# EasyEDA Pro project ProPrj_pico debugger_2026-04-05.epro

# Schematic Schematic1
Board Name: Board1; Create Date: 2026-04-02; Page Name: P1; Project Name: pico debugger; Schematic Name: Schematic1; Update Date: 2026-04-02; Company: EasyEDA.com; Page Size: A3; Version: V1.0
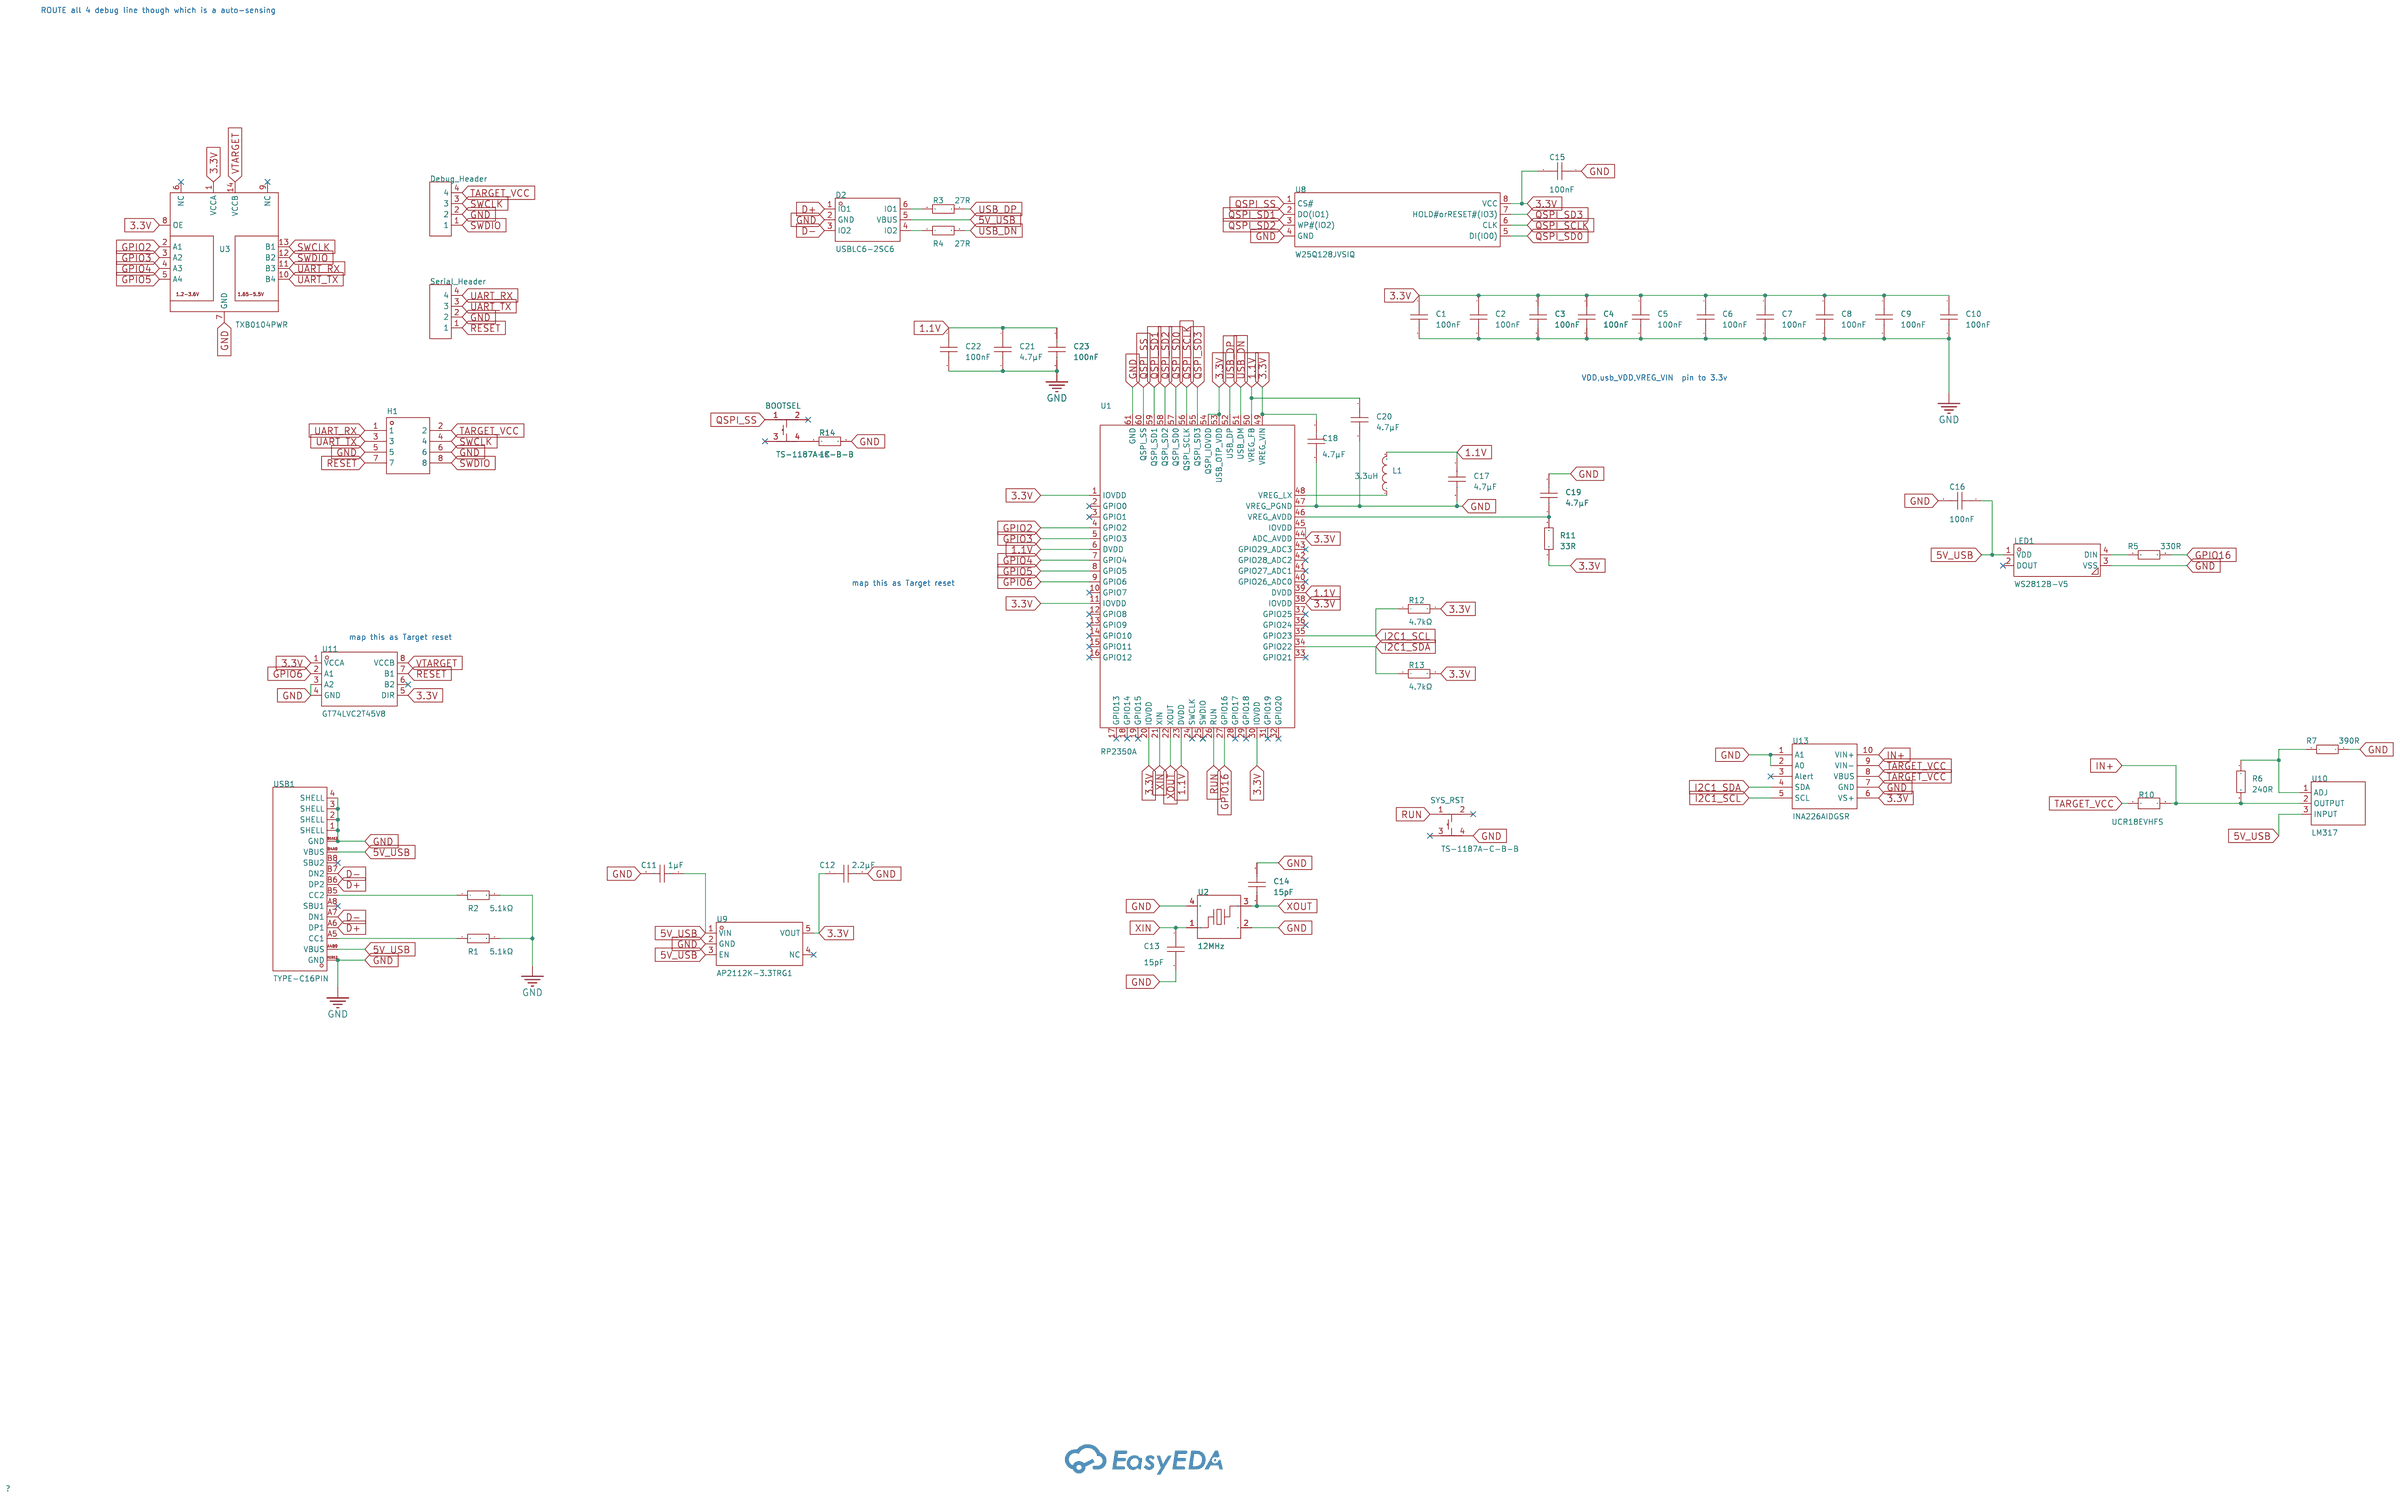
[diagram p0: schematic sheet]

## Parts
BOOTSEL  TS-1187A-C-B-B  [SW-SMD_4P-L5.1-W5.1-P3.70-LS6.5-TL_H1.6]
C1  100nF  [C0603]
C2  100nF  [C0603]
C3  100nF  [C0603]
C4  100nF  [C0603]
C5  100nF  [C0603]
C6  100nF  [C0603]
C7  100nF  [C0603]
C8  100nF  [C0603]
C9  100nF  [C0603]
C10  100nF  [C0603]
C11  1µF  [C0603]
C12  2.2µF  [C0603]
C13  15pF  [C0603]
C14  15pF  [C0603]
C15  100nF  [C0603]
C16  100nF  [C0603]
C17  4.7µF  [C0603]
C18  4.7µF  [C0603]
C19  4.7µF  [C0603]
C20  4.7µF  [C0603]
C21  4.7µF  [C0603]
C22  100nF  [C0603]
C23  100nF  [C0603]
D2  USBLC6-2SC6  [SOT-23-6_L2.9-W1.6-P0.95-LS2.8-BL]
Debug_Header  -  [HDR-TH_4P-P2.54-V-M]
H1  -  [HDR-TH_8P-P2.54-V-M-R2-C4-S2.54]
L1  3.3uH  [IND-SMD_L2.0-W1.6_AOTA-B201610S3R3-101-T]
LED1  WS2812B-V5  [LED-SMD_4P-L5.0-W5.0-LS5.4-TL-1]
R1  5.1kΩ  [R0402]
R2  5.1kΩ  [R0402]
R3  27R  [R0402]
R4  27R  [R0402]
R5  330R  [R0402]
R6  240R  [R0402]
R7  390R  [R0402]
R10  UCR18EVHFS  [R1206]
R11  33R  [R0402]
R12  4.7kΩ  [R0402]
R13  4.7kΩ  [R0402]
R14  1K  [R0402]
Serial_Header  -  [HDR-TH_4P-P2.54-V-M]
SYS_RST  TS-1187A-C-B-B  [SW-SMD_4P-L5.1-W5.1-P3.70-LS6.5-TL_H1.6]
U1  RP2350A  [QFN-60_L7.0-W7.0-P0.40-TL-EP3.4]
U2  12MHz  [CRYSTAL-SMD_4P-L3.2-W2.5-BL]
U3  TXB0104PWR  [TSSOP-14_L5.0-W4.4-P0.65-LS6.4-BL]
U8  W25Q128JVSIQ  [SOIC-8_L5.3-W5.3-P1.27-LS8.0-BL]
U9  AP2112K-3.3TRG1  [SOT-25-5_L2.9-W1.6-P0.95-LS2.8-BL]
U10  LM317  [TO-252-3_L6.5-W5.9-P4.60-LS10.0-BL]
U11  GT74LVC2T45V8  [VSSOP-8_L2.3-W2.0-P0.50-LS3.1-BL]
U13  INA226AIDGSR  [MSOP-10_L3.0-W3.0-P0.50-LS5.0-BL]
USB1  TYPE-C16PIN  [USB-C-SMD_TYPE-C16PIN]

## Library data of the parts
BOOTSEL SYS_RST = TS-1187A-C-B-B: Circuit:SPST Actuator Style:Round Button Operating Force:260gf Mounting Style:Brick nogging Switch Length:5.1mm Switch Width:5.1mm Switch Height:1.6mm Strike Gundam:不带 Contact Current:50mA Voltage Rating (DC):12V Insulation Resistance:- Actuator/Cap Color; LCSC Part Name: 5.1*5.1*1.6mm 立贴 轻触开关; Supplier Part: C1121873; Manufacturer: XKB Connectivity(中国星坤); Supplier Footprint: SMD; JLCPCB Part Class: Extended Part; Datasheet: https://atta.szlcsc.com/upload/public/pdf/source/20211011/CF465E46D2427DB66E133733EF19F823.pdf; Supplier: LCSC; Circuit: SPST; Actuator Style: Round Button; Operating Force: 260gf; Mounting Style: Brick nogging; Switch Length: 5.1mm; Switch Width: 5.1mm; Switch Height: 1.6mm; Strike Gundam: 不带; Contact Current: 50mA; Voltage Rating (DC): 12V; Actuator/Cap Color: 金色; With Lamp: No; Mechanical Life: 10万次; Operating Temperature: -30℃~+85℃
C1-C23 = CAP_0603: Supplier Footprint: 0603
D2 = USBLC6-2SC6_C2827654: Polarity:Unidirectional Reverse Stand-Off Voltage (Vrwm):5V Clamping Voltage:12V Peak Pulse Current (Ipp):6A Peak Pulse Power Dissipation (Ppp):150W Voltage - Breakdown:6V Reverse Leakage Current (Ir):80nA Number of Channels:2 Operating Temperature:-55℃~+; LCSC Part Name: ESD，可防30kV静电; Supplier Part: C2827654; Manufacturer: TECH PUBLIC(台舟); Supplier Footprint: SOT-23-6; JLCPCB Part Class: Extended Part; Datasheet: https://item.szlcsc.com/datasheet/USBLC6-2SC6/2973336.html; Supplier: LCSC; Polarity: Unidirectional; Reverse Stand-Off Voltage (Vrwm): 5V; Clamping Voltage: 12V; Peak Pulse Current (Ipp): 6A; Peak Pulse Power Dissipation (Ppp): 150W; Voltage - Breakdown: 6V; Reverse Leakage Current (Ir): 80nA; Number of Channels: 2; Operating Temperature: -55℃~+125℃; level of protection: IEC 61000-4-2；IEC 61000-4-4；IEC 61000-4-5; Type: ESD; Junction Capacitance: 0.35pF
Debug_Header Serial_Header = HDR-M_2.54_1x4P: Supplier Footprint: Through
H1 = HDR-M_2.54_2x4: Supplier Footprint: Through
L1 = AOTA-B201610S3R3-101-T: Inductance:3.3uH Current Rating:2.1A Current - Saturation(Isat):2.4A DC Resistance(DCR):115mΩ Type:Molded Inductor; LCSC Part Name: 3.3uH 2.4A; Supplier Part: C42411119; Manufacturer: ABRACON; Supplier Footprint: 0806; JLCPCB Part Class: Extended Part; Datasheet: https://item.szlcsc.com/datasheet/AOTA-B201610S3R3-101-T/44392932.html; Supplier: LCSC; Current Rating: 2.1A; Current - Saturation(Isat): 2.4A; DC Resistance(DCR): 115mΩ; Type: Molded Inductor
LED1 = WS2812B-V5_C2846931: Wavelength:G:520nm；B:471nm；R:621nm Luminous Intensity:B:215mcd；R:310mcd；G:780mcd Fixed-Frequency Pwm Mode:2kHz Data Transmission Rate:800Kbit/s Voltage - Supply:3.7V~5.3V Voltage - Supply:3.7V~5.3V Quiescent Current:0.6mA Operating Temperature:-40℃~+65℃ P; LCSC Part Name: 智能外控集成LED光源; Supplier Part: C2846931; Manufacturer: worldsemi; Supplier Footprint: SMD5050-4P; JLCPCB Part Class: Extended Part; Datasheet: https://item.szlcsc.com/datasheet/WS2812B-V5/3042466.html; Supplier: LCSC; Wavelength: G:520nm；B:471nm；R:621nm; Luminous Intensity: B:215mcd；R:310mcd；G:780mcd; Fixed-Frequency Pwm Mode: 2kHz; Data Transmission Rate: 800Kbit/s; Voltage - Supply: 3.7V~5.3V; Quiescent Current: 0.6mA; Operating Temperature: -40℃~+65℃; Peak Wavelength: G:520nm；R:621nm；B:471nm; Length: 5mm; Width: 5mm; Height: 1.57mm
R1-R7 R11-R14 = Res_0402: Supplier Footprint: 0402
R10 = UCR18EVHFS: Supplier Part: C20110261; Manufacturer: ROHM(罗姆); JLCPCB Part Class: Extended Part; Datasheet: https://item.szlcsc.com/datasheet/UCR18EVHFS/21439155.html; Supplier: LCSC
U1 = RP2350A_C42411118: LCSC Part Name: 微控制器; Supplier Part: C42411118; Manufacturer: Raspberry Pi(树莓派); Supplier Footprint: QFN-60-EP(7x7); JLCPCB Part Class: Extended Part; Datasheet: https://item.szlcsc.com/datasheet/RP2350A/44392931.html; Supplier: LCSC
U2 = ABM8-272-T3_C20625731: Type:Crystal Oscillator Frequency:12MHz Normal temperature Frequency Tolerance:±30ppm Normal temperature Frequency Tolerance:±30ppm Load Capacitance:10pF Frequency Stability:±30ppm Frequency Stability:±30ppm Equivalent Series Resistance(ESR):50Ω Operating; LCSC Part Name: 12MHz ±30ppm 10pF; Supplier Part: C20625731; Manufacturer: ABRACON; Manufacturer Part: ABM8-272-T3; Supplier Footprint: SMD3225-4P; JLCPCB Part Class: Extended Part; Datasheet: https://item.szlcsc.com/datasheet/ABM8-272-T3/22032038.html; Supplier: LCSC; Type: Crystal Oscillator; Normal temperature Frequency Tolerance: ±30ppm; Load Capacitance: 10pF; Frequency Stability: ±30ppm; Equivalent Series Resistance(ESR): 50Ω; Operating Temperature: -40℃~+85℃
U3 = TXB0104PWR: Channel Type:Bidirectional Input Signal:CMOS Output Signal:CMOS Data Rate:100Mbps Voltage - Supply(VCCA):1.2V~3.6V Voltage - Supply(VCCA):1.2V~3.6V Voltage - Supply(VCCB):1.65V~5.5V Voltage - Supply(VCCB):1.65V~5.5V Number of Elements:1 Number of Circuits; LCSC Part Name: 100Mbps 4位双向电平转换器; Supplier Part: C60708; Manufacturer: TI(德州仪器); Supplier Footprint: TSSOP-14; JLCPCB Part Class: Extended Part; Datasheet: http://www.ti.com/cn/lit/gpn/txb0104; Supplier: LCSC; Channel Type: Bidirectional; Input Signal: CMOS; Output Signal: CMOS; Data Rate: 100Mbps; Voltage - Supply(VCCA): 1.2V~3.6V; Voltage - Supply(VCCB): 1.65V~5.5V; Number of Elements: 1; Number of Circuits: 4; Output Type: Tri-State; Operating Temperature: -40℃~+85℃; Features: Auto Direction Detection
U8 = W25Q128JVSIQ_C113767: Interface:SPI Memory Size:- Clock Frequency:133MHz Voltage - Supply:2.7V~3.6V Voltage - Supply:2.7V~3.6V Program / Erase Cycles:100,000 Cycles Page Programming Time (Tpp):3ms Operating Temperature:- Operating Temperature:-; LCSC Part Name: 支持双路/四路SPI接口的3V、128Mbit 串行闪存; Supplier Part: C113767; Manufacturer: Winbond(华邦); Supplier Footprint: SOIC-8-208mil; JLCPCB Part Class: Extended Part; Datasheet: https://item.szlcsc.com/datasheet/W25Q128JVSIQ/115003.html; Supplier: LCSC; Interface: SPI; Clock Frequency: 133MHz; Voltage - Supply: 2.7V~3.6V; Program / Erase Cycles: 100,000 Cycles; Page Programming Time (Tpp): 3ms
U9 = AP2112K-3.3TRG1: Output Type:Fixed Voltage - Supply:6V Output Voltage:3.3V Output Voltage:3.3V Output Current:600mA Power Supply Rejection Ratio (PSRR):65dB@(1kHz) Voltage Dropout:250mV@(600mA) standby current:55uA Noise:50uVrms Features:Enable；Over Temperature Protection; LCSC Part Name: 输入6V 输出3.3V 600mA; Supplier Part: C51118; Manufacturer: DIODES(美台); Supplier Footprint: SOT-25-5; JLCPCB Part Class: Extended Part; Datasheet: https://item.szlcsc.com/datasheet/AP2112K-3.3TRG1/52131.html; Supplier: LCSC; Output Type: Fixed; Voltage - Supply: 6V; Output Voltage: 3.3V; Output Current: 600mA; Power Supply Rejection Ratio (PSRR): 65dB@(1kHz); Voltage Dropout: 250mV@(600mA); standby current: 55uA; Noise: 50uVrms; Features: Enable；Over Temperature Protection；Over Current Protection; Operating Temperature: -40℃~+85℃@(Ta); Output Configuration: Positive; Number of Outputs: 1
U10 = LM317_C42457465: Output Type:Adjustable Voltage - Supply:40V Output Voltage:1.2V~37V Output Voltage:1.2V~37V Output Current:1.5A Power Supply Rejection Ratio (PSRR):65dB@(120Hz) Voltage Dropout:- standby current:- Noise:- Features:Short Circuit Protection；Over Temperature; LCSC Part Name: 1.2V~37V 1.5A 40V; Supplier Part: C42457465; Manufacturer: GOODWORK(固得沃克); Supplier Footprint: TO-252; JLCPCB Part Class: Extended Part; Datasheet: https://item.szlcsc.com/datasheet/LM317/44529604.html; Supplier: LCSC; Output Type: Adjustable; Voltage - Supply: 40V; Output Voltage: 1.2V~37V; Output Current: 1.5A; Power Supply Rejection Ratio (PSRR): 65dB@(120Hz); Features: Short Circuit Protection；Over Temperature Protection; Operating Temperature: 0℃~+125℃; Output Configuration: Positive; Number of Outputs: 1
U11 = GT74LVC2T45V8: Input type:- output type:Tri-State Voltage - Supply:1.65V~5.5V Voltage - Supply:1.65V~5.5V Number of Elements:2 Number of Bits per Element:2 Channel Type:Bidirectional Current - Output Low(IOL):32mA Current - Output High(IOH):62mA Logic Family:74LVC Opera; LCSC Part Name: 具备电压转换功能的双位双电源总线收发器; Supplier Part: C22356905; Manufacturer: GTIC(谷泰微); Supplier Footprint: VSSOP-8; JLCPCB Part Class: Extended Part; Datasheet: https://item.szlcsc.com/datasheet/GT74LVC2T45V8/23790625.html; Supplier: LCSC; output type: Tri-State; Voltage - Supply: 1.65V~5.5V; Number of Elements: 2; Number of Bits per Element: 2; Channel Type: Bidirectional; Current - Output Low(IOL): 32mA; Current - Output High(IOH): 62mA; Logic Family: 74LVC; Operating Temperature: -40℃~+125℃; Quiescent Current: 15uA; Propagation Delay: 3.5ns@3.3V,15pF
U13 = INA226AIDGSR: Number of Channels:- Vcm - Common Mode Voltage:300mV~40V Vcm - Common Mode Voltage:300mV~40V Gain:- Bandwidth:- Ib - Input Bias Current:10nA Vos - Input Offset Voltage:2.5uV Operating Temperature:-40℃~+125℃ Operating Temperature:-40℃~+125℃ Differential Vo; LCSC Part Name: 高侧/低侧测量双向电流/功率监视器，具有I²C兼容接口; Supplier Part: C49851; Manufacturer: TI(德州仪器); Supplier Footprint: VSOP-10; JLCPCB Part Class: Extended Part; Datasheet: https://item.szlcsc.com/datasheet/INA226AIDGSR/50860.html; Supplier: LCSC; Vcm - Common Mode Voltage: 300mV~40V; Ib - Input Bias Current: 10nA; Vos - Input Offset Voltage: 2.5uV; Operating Temperature: -40℃~+125℃; Differential Voltage: -40V~+40V; Single Supply: 2.7V~5.5V; Quiescent Current: 330uA; Input Offset Voltage Drift(Vos TC): 0.1uV/℃; Common Mode Rejection Ratio (CMRR): 140dB
USB1 = TYPE-C16PIN: Connector Type:Type-C Protocol Standard:- Gender:Female Mounting Type:Surface Mount, Right Angle Number of Contacts:16P Number of Ports:1 Current Rating-Power:3A Voltage Rating:30V Connect-Disconnect Life:10,000 Cycles Supplementary Features:- Center Heig; LCSC Part Name: 16P卧贴母座; Supplier Part: C393939; Manufacturer: SHOU HAN(首韩); Supplier Footprint: SMD; JLCPCB Part Class: Extended Part; Datasheet: https://item.szlcsc.com/datasheet/TYPE-C16PIN/372551.html; Supplier: LCSC; Connector Type: Type-C; Gender: Female; Mounting Type: Surface Mount, Right Angle; Number of Contacts: 16P; Number of Ports: 1; Current Rating-Power: 3A; Voltage Rating: 30V; Connect-Disconnect Life: 10,000 Cycles; Detection color: Black; Operating Temperature: -40℃~+85℃

## Nets
1.1V: C17.1 C20.1 C21.1 C22.1 C23.1 L1.2 U1.6(DVDD) U1.23(DVDD) U1.39(DVDD) U1.50(VREG_FB)
3.3V: C1.1 C2.1 C3.1 C4.1 C5.1 C6.1 C7.1 C8.1 C9.1 C10.1 C12.1 C15.2 C18.1 R11.1 R12.2 R13.2 U1.1(IOVDD) U1.11(IOVDD) U1.20(IOVDD) U1.30(IOVDD) U1.38(IOVDD) U1.44(ADC_AVDD) U1.45(IOVDD) U1.49(VREG_VIN) U1.53(USB_OTP_VDD) U1.54(QSPI_IOVDD) U3.1(VCCA) U3.8(OE) U8.8(VCC) U9.5(VOUT) U11.1(VCCA) U11.5(DIR) U13.6(VS+)
5V_USB: C11.1 C16.1 D2.5(VBUS) LED1.1(VDD) U9.1(VIN) U9.3(EN) U10.3(INPUT) USB1.A4B9(VBUS) USB1.B4A9(VBUS)
GND: C1.2 C2.2 C3.2 C4.2 C5.2 C6.2 C7.2 C8.2 C9.2 C10.2 C11.2 C12.2 C13.2 C14.1 C15.1 C16.2 C17.2 C18.2 C19.2 C20.2 C21.2 C22.2 C23.2 D2.2(GND) Debug_Header.2 H1.5 H1.6 LED1.3(VSS) R1.2 R2.2 R7.2 R14.2 Serial_Header.2 SYS_RST.4 U1.47(VREG_PGND) U1.61(GND) U2.2(GND) U2.4(GND) U3.7(GND) U8.4(GND) U9.2(GND) U11.3(A2) U11.4(GND) U13.1(A1) U13.2(A0) U13.7(GND) USB1.1(SHELL) USB1.2(SHELL) USB1.3(SHELL) USB1.4(SHELL) USB1.A1B12(GND) USB1.B1A12(GND)
D+: D2.1(IO1) USB1.A6(DP1) USB1.B6(DP2)
D-: D2.3(IO2) USB1.A7(DN1) USB1.B7(DN2)
GPIO2: U1.4(GPIO2) U3.2(A1)
GPIO3: U1.5(GPIO3) U3.3(A2)
GPIO4: U1.7(GPIO4) U3.4(A3)
GPIO5: U1.8(GPIO5) U3.5(A4)
GPIO6: U1.9(GPIO6) U11.2(A1)
GPIO16: R5.2 U1.27(GPIO16)
I2C1_SCL: R12.1 U1.35(GPIO23) U13.5(SCL)
I2C1_SDA: R13.1 U1.34(GPIO22) U13.4(SDA)
IN+: R6.2 R10.2 U10.2(OUTPUT) U13.10(VIN+)
QSPI_SCLK: U1.56(QSPI_SCLK) U8.6(CLK)
QSPI_SD0: U1.57(QSPI_SD0) U8.5(DI(IO0))
QSPI_SD1: U1.59(QSPI_SD1) U8.2(DO(IO1))
QSPI_SD2: U1.58(QSPI_SD2) U8.3(WP#(IO2))
QSPI_SD3: U1.55(QSPI_SD3) U8.7(HOLD#orRESET#(IO3))
QSPI_SS: BOOTSEL.1 U1.60(QSPI_SS) U8.1(CS#)
RESET: H1.7 Serial_Header.1 U11.7(B1)
RUN: SYS_RST.1 U1.26(RUN)
SWCLK: Debug_Header.3 H1.4 U3.13(B1)
SWDIO: Debug_Header.1 H1.8 U3.12(B2)
TARGET_VCC: Debug_Header.4 H1.2 R10.1 U13.8(VBUS) U13.9(VIN-)
UART_RX: H1.1 Serial_Header.4 U3.11(B3)
UART_TX: H1.3 Serial_Header.3 U3.10(B4)
USB_DN: R4.2 U1.51(USB_DM)
USB_DP: R3.1 U1.52(USB_DP)
VTARGET: U3.14(VCCB) U11.8(VCCB)
XIN: C13.1 U1.21(XIN) U2.1
XOUT: C14.2 U1.22(XOUT) U2.3
$1N4816: R1.1 USB1.A5(CC1)
$1N4872: R2.1 USB1.B5(CC2)
$1N5063: D2.6(IO1) R3.2
$1N5093: D2.4(IO2) R4.1
$1N6963: LED1.4(DIN) R5.1
$1N6977: R6.1 R7.1 U10.1(ADJ)
$1N7783: L1.1 U1.48(VREG_LX)
$1N8068: C19.1 R11.2 U1.46(VREG_AVDD)
$1N9279: BOOTSEL.4 R14.1

Not connected (* = marked no-connect by the designer): BOOTSEL 2* 3*; LED1 2(DOUT)*; SYS_RST 2* 3*; U1 2(GPIO0)* 3(GPIO1)* 10(GPIO7)* 12(GPIO8)* 13(GPIO9)* 14(GPIO10)* 15(GPIO11)* 16(GPIO12)* 17(GPIO13)* 18(GPIO14)* 19(GPIO15)* 24(SWCLK)* 25(SWDIO)* 28(GPIO17)* 29(GPIO18)* 31(GPIO19)* 32(GPIO20)* 33(GPIO21)* 36(GPIO24)* 37(GPIO25)* 40(GPIO26_ADC0)* 41(GPIO27_ADC1)* 42(GPIO28_ADC2)* 43(GPIO29_ADC3)*; U3 6(NC)* 9(NC)*; U9 4(NC)*; U11 6(B2)*; U13 3(Alert)*; USB1 A8(SBU1)* B8(SBU2)*

## Notes on the sheet
- ROUTE all 4 debug line though which is a auto-sensing
- VDD,usb_VDD,VREG_VIN  pin to 3.3v
- map this as Target reset
- map this as Target reset

# Board PCB1
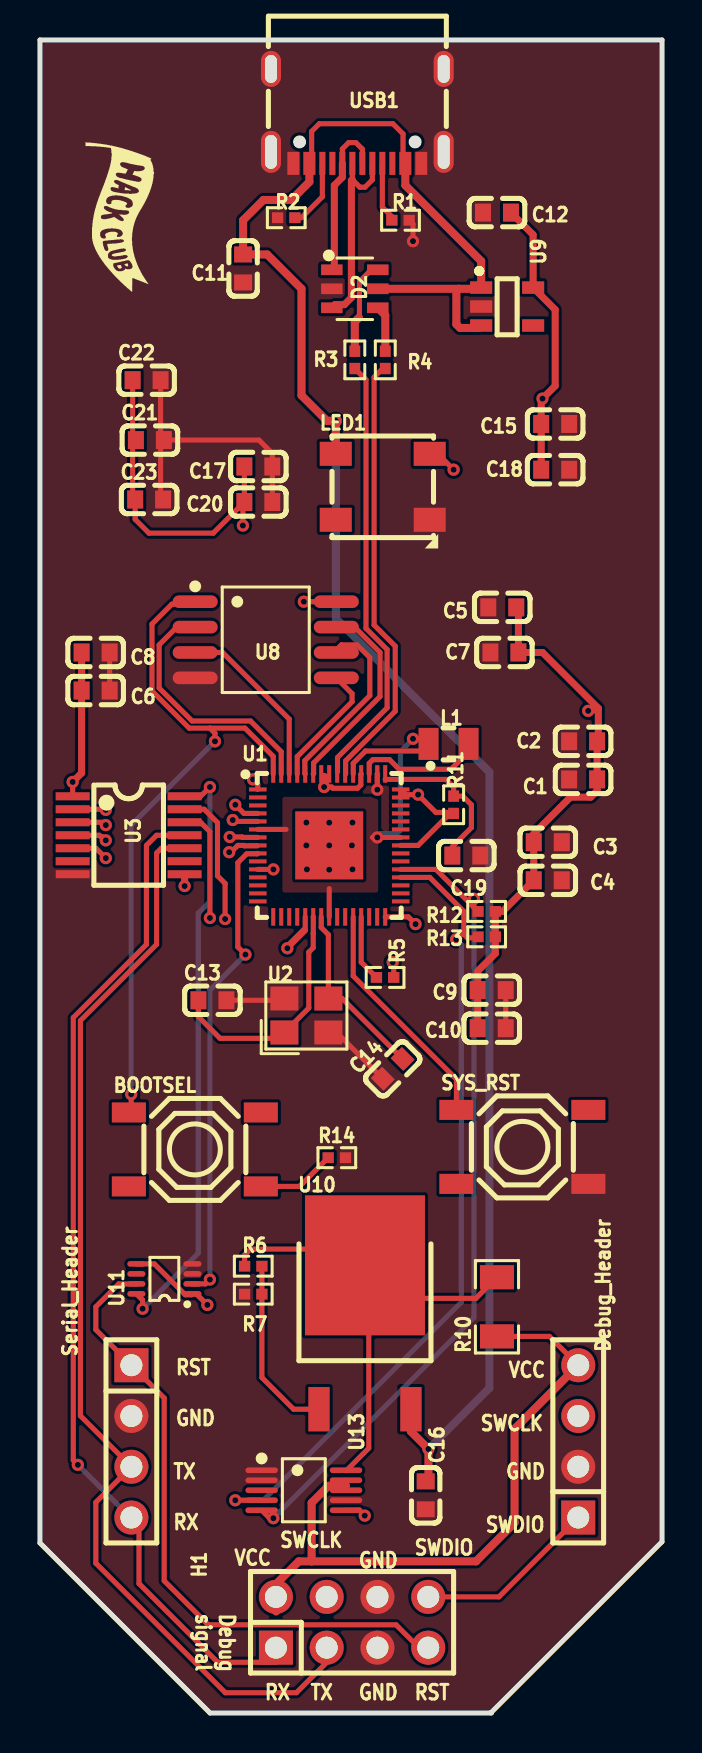
[diagram p1: board, top side]
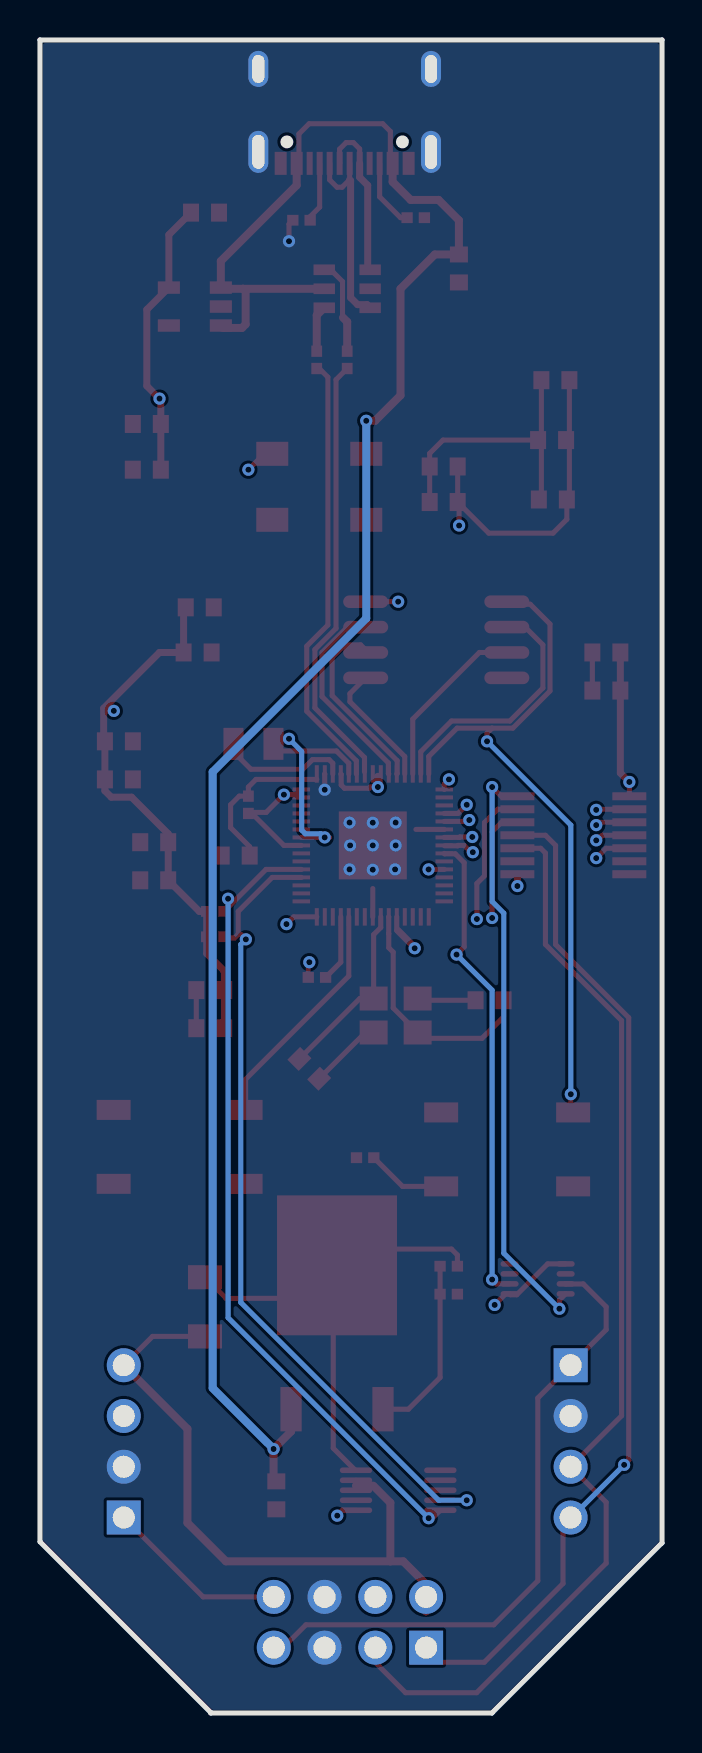
[diagram p2: board, bottom side, seen from below]

Outline 31.12 x 83.69 mm; copper layers: Top Layer, GND, POWERS, Bottom Layer. Coordinates in mm from the lower left corner of the outline.
Outline path: 0,83.69 31.12,83.69 31.12,8.57 22.57,0.03 22.57,0 8.51,0 0,8.51 0,83.69
Stack: Top Layer 0.035mm Outer layer thickness 1oz / Dielectric1 0.2104mm 7628 RC49% 8.6mil / GND 0.0152mm Inner layer thickness / Dielectric2 1.065mm 1.1mm H/HOZ Copper / POWERS 0.0152mm Inner layer thickness / Dielectric3 0.2104mm 7628 RC49% 8.6mil / Bottom Layer 0.035mm Outer layer thickness 1oz

## Design rules (mm)
net USB_DP: DP1
net USB_DN: DP1
template: Custom Config
spacing copperThickness1oz (default): track to track 0.102, other pairs 0.152 to 0.3
spacing copperThickness2oz: track to track 0.203, other pairs 0.152 to 0.3
track width copperThickness1oz (default): min 0.127, default 0.254, max 2.54
track width copperThickness2oz: min 0.203, default 0.254, max 2.54
differential pair differentialPair (default): width min 0.127, default 0.254, max 2.54; gap min 0.152, default 0.152
via viaSize (default): diameter min 0.5, default 0.61, max 10; hole min 0.3, default 0.305, max 6.3

## Placement (name value [footprint] x y rotation side)
BOOTSEL  TS-1187A-C-B-B  [SW-SMD_4P-L5.1-W5.1-P3.70-LS6.5-TL_H1.6]  7.75 28.19 0 top
C1  100nF  [C0603]  27.17 46.7 180 top
C2  100nF  [C0603]  27.17 48.61 180 top
C3  100nF  [C0603]  25.4 43.56 0 top
C4  100nF  [C0603]  25.4 41.66 0 top
C5  100nF  [C0603]  23.12 55.31 180 top
C6  100nF  [C0603]  2.78 51.15 0 top
C7  100nF  [C0603]  23.23 53.05 180 top
C8  100nF  [C0603]  2.78 53.05 0 top
C9  100nF  [C0603]  22.6 36.16 0 top
C10  100nF  [C0603]  22.6 34.26 0 top
C11  1µF  [C0603]  10.16 72.26 270 top
C12  2.2µF  [C0603]  22.86 75.06 180 top
C13  15pF  [C0603]  8.63 35.65 0 top
C14  15pF  [C0603]  17.64 32.23 45 top
C15  100nF  [C0603]  25.77 64.48 180 top
C16  100nF  [C0603]  19.29 10.89 270 top
C17  4.7µF  [C0603]  10.92 62.36 0 top
C18  4.7µF  [C0603]  25.77 62.2 0 top
C19  4.7µF  [C0603]  21.33 42.89 0 top
C20  4.7µF  [C0603]  10.92 60.58 0 top
C21  4.7µF  [C0603]  5.5 63.68 0 top
C22  100nF  [C0603]  5.33 66.67 0 top
C23  100nF  [C0603]  5.46 60.71 0 top
D2  USBLC6-2SC6  [SOT-23-6_L2.9-W1.6-P0.95-LS2.8-BL]  15.75 71.25 270 top
Debug_Header  -  [HDR-TH_4P-P2.54-V-M]  26.92 13.59 90 top
H1  -  [HDR-TH_8P-P2.54-V-M-R2-C4-S2.54]  15.61 4.54 0 top
L1  3.3uH  [IND-SMD_L2.0-W1.6_AOTA-B201610S3R3-101-T]  20.44 48.48 180 top
LED1  WS2812B-V5  [LED-SMD_4P-L5.0-W5.0-LS5.4-TL-1]  17.15 61.34 0 top
R1  5.1kΩ  [R0402]  18.03 74.68 0 top
R2  5.1kΩ  [R0402]  12.32 74.8 180 top
R3  27R  [R0402]  15.75 67.69 90 top
R4  27R  [R0402]  17.27 67.69 270 top
R5  330R  [R0402]  17.26 36.8 180 top
R6  240R  [R0402]  10.67 22.35 180 top
R7  390R  [R0402]  10.67 20.95 180 top
R10  UCR18EVHFS  [R1206]  22.86 20.32 90 top
R11  33R  [R0402]  20.69 45.43 90 top
R12  4.7kΩ  [R0402]  22.34 40.1 0 top
R13  4.7kΩ  [R0402]  22.34 38.83 0 top
R14  1K  [R0402]  14.85 27.78 0 top
Serial_Header  -  [HDR-TH_4P-P2.54-V-M]  4.57 13.59 270 top
SYS_RST  TS-1187A-C-B-B  [SW-SMD_4P-L5.1-W5.1-P3.70-LS6.5-TL_H1.6]  24.13 28.32 0 top
U1  RP2350A  [QFN-60_L7.0-W7.0-P0.40-TL-EP3.4]  14.47 43.4 0 top
U2  12MHz  [CRYSTAL-SMD_4P-L3.2-W2.5-BL]  13.33 34.89 0 top
U3  TXB0104PWR  [TSSOP-14_L5.0-W4.4-P0.65-LS6.4-BL]  4.44 43.91 270 top
U8  W25Q128JVSIQ  [SOIC-8_L5.3-W5.3-P1.27-LS8.0-BL]  11.29 53.69 270 top
U9  AP2112K-3.3TRG1  [SOT-25-5_L2.9-W1.6-P0.95-LS2.8-BL]  23.37 70.36 270 top
U10  LM317  [TO-252-3_L6.5-W5.9-P4.60-LS10.0-BL]  16.26 18.8 0 top
U11  GT74LVC2T45V8  [VSSOP-8_L2.3-W2.0-P0.50-LS3.1-BL]  6.22 21.72 90 top
U13  INA226AIDGSR  [MSOP-10_L3.0-W3.0-P0.50-LS5.0-BL]  13.2 11.14 270 top
USB1  TYPE-C16PIN  [USB-C-SMD_TYPE-C16PIN]  15.88 79.88 180 top

## Footprints (pads in the part's own frame, mm; a bottom-side part is the same pattern mirrored in y, then rotated)
C0603
  rect 0.8x0.9 smd: 1(-0.7,0) 2(0.7,0)
CRYSTAL-SMD_4P-L3.2-W2.5-BL
  rect 1.4x1.2 smd: 1(-1.1,-0.85) 2(1.1,-0.85) 3(1.1,0.85) 4(-1.1,0.85)
HDR-TH_4P-P2.54-V-M
  rect 1.7x1.7 hole 1.1: 1(-3.81,0)
  round 1.7 hole 1.1: 2(-1.27,0) 3(1.27,0) 4(3.81,0)
HDR-TH_8P-P2.54-V-M-R2-C4-S2.54
  rect 1.7x1.7 hole 1.1: 1(-3.81,-1.27)
  round 1.7 hole 1.1: 2(-3.81,1.27) 3(-1.27,-1.27) 4(-1.27,1.27) 5(1.27,-1.27) 6(1.27,1.27) 7(3.81,-1.27) 8(3.81,1.27)
IND-SMD_L2.0-W1.6_AOTA-B201610S3R3-101-T
  rect 1x1.6 smd: 1(-1,0) 2(1,0)
LED-SMD_4P-L5.0-W5.0-LS5.4-TL-1
  rect 1.6x1.2 smd: 1(-2.35,1.65) 2(-2.35,-1.65) 3(2.35,-1.65) 4(2.35,1.65)
MSOP-10_L3.0-W3.0-P0.50-LS5.0-BL
  oval 0.28x1.62 smd: 1(-1,-2.11) 2(-0.5,-2.11) 3(0,-2.11) 4(0.5,-2.11) 5(1,-2.11) 6(1,2.11) 7(0.5,2.11) 8(0,2.11) 9(-0.5,2.11) 10(-1,2.11)
QFN-60_L7.0-W7.0-P0.40-TL-EP3.4
  rect 0.875x0.2 smd: 1(-3.575,2.8) 2(-3.575,2.4) 3(-3.575,2) 4(-3.575,1.6) 5(-3.575,1.2) 6(-3.575,0.8) 7(-3.575,0.4) 8(-3.575,0) 9(-3.575,-0.4) 10(-3.575,-0.8) 11(-3.575,-1.2) 12(-3.575,-1.6) 13(-3.575,-2) 14(-3.575,-2.4) 15(-3.575,-2.8) 31(3.575,-2.8) 32(3.575,-2.4) 33(3.575,-2.001) 34(3.575,-1.6) 35(3.575,-1.2) 36(3.575,-0.8) 37(3.575,-0.4) 38(3.575,-0.001) 39(3.575,0.4) 40(3.575,0.8) 41(3.575,1.2) 42(3.575,1.6) 43(3.575,2) 44(3.575,2.4) 45(3.575,2.8)
  rect 0.2x0.875 smd: 16(-2.8,-3.575) 17(-2.4,-3.575) 18(-2,-3.575) 19(-1.6,-3.575) 20(-1.2,-3.575) 21(-0.8,-3.575) 22(-0.4,-3.575) 23(0,-3.575) 24(0.4,-3.575) 25(0.8,-3.575) 26(1.2,-3.575) 27(1.6,-3.575) 28(2,-3.575) 29(2.4,-3.575) 30(2.8,-3.575) 46(2.8,3.575) 47(2.4,3.575) 48(2,3.575) 49(1.6,3.575) 50(1.2,3.575) 51(0.8,3.575) 52(0.4,3.575) 53(0,3.575) 54(-0.4,3.575) 55(-0.8,3.575) 56(-1.2,3.575) 57(-1.6,3.575) 58(-2,3.575) 59(-2.4,3.575) 60(-2.8,3.575)
  rect 3.4x3.4 smd: 61(0,0)
R0402
  rect 0.566x0.54 smd: 1(-0.433,0) 2(0.433,0)
R1206
  rect 1.208x1.701 smd: 1(-1.479,0) 2(1.479,0)
SOIC-8_L5.3-W5.3-P1.27-LS8.0-BL
  oval 0.63x2.25 smd: 1(-1.905,-3.53) 2(-0.635,-3.53) 3(0.635,-3.53) 4(1.905,-3.53) 5(1.905,3.53) 6(0.635,3.53) 7(-0.635,3.53) 8(-1.905,3.53)
SOT-23-6_L2.9-W1.6-P0.95-LS2.8-BL
  rect 0.532x1.072 smd: 1(-0.95,-1.149) 2(0,-1.149) 3(0.95,-1.149) 4(0.95,1.149) 5(0,1.149) 6(-0.95,1.149)
SOT-25-5_L2.9-W1.6-P0.95-LS2.8-BL
  rect 0.623x1.105 smd: 1(-0.95,-1.3) 2(-0.001,-1.3) 3(0.95,-1.3) 4(0.95,1.3) 5(-0.95,1.3)
SW-SMD_4P-L5.1-W5.1-P3.70-LS6.5-TL_H1.6
  rect 1.7x1 smd: 1(-3.3,1.85) 2(3.3,1.85) 3(-3.3,-1.85) 4(3.3,-1.85)
TO-252-3_L6.5-W5.9-P4.60-LS10.0-BL
  rect 1.064x2.219 smd: 1(-2.3,-3.599) 3(2.3,-3.599)
  rect 6x7 smd: 2(0,3.599)
TSSOP-14_L5.0-W4.4-P0.65-LS6.4-BL
  rect 0.4x1.7 smd: 1(-1.95,-2.8) 2(-1.3,-2.8) 3(-0.65,-2.8) 4(0,-2.8) 5(0.65,-2.8) 6(1.3,-2.8) 7(1.95,-2.8) 8(1.95,2.8) 9(1.3,2.8) 10(0.65,2.8) 11(0,2.8) 12(-0.65,2.8) 13(-1.3,2.8) 14(-1.95,2.8)
USB-C-SMD_TYPE-C16PIN
  oval 1x2.1 hole 0.6x1.7: 1(-4.32,1.788) 2(4.32,1.788)
  oval 1x1.8 hole 0.6x1.4: 3(-4.32,-2.362) 4(4.32,-2.362)
  rect 0.6x1.15 smd: A1B12(-3.2,2.362) A4B9(-2.4,2.362) B1A12(3.2,2.362) B4A9(2.4,2.362)
  rect 0.3x1.15 smd: A5(-1.25,2.362) A6(-0.25,2.362) A7(0.25,2.362) A8(1.25,2.362) B5(1.75,2.362) B6(0.75,2.362) B7(-0.75,2.362) B8(-1.75,2.362)
VSSOP-8_L2.3-W2.0-P0.50-LS3.1-BL
  oval 0.28x0.905 smd: 1(-0.75,-1.403) 2(-0.25,-1.403) 3(0.25,-1.403) 4(0.75,-1.403) 5(0.75,1.403) 6(0.25,1.403) 7(-0.25,1.403) 8(-0.75,1.403)

## Nets
As in the schematic.

Pads without a net: BOOTSEL 2 3; LED1 2; SYS_RST 2 3; U1 2 3 10 12 13 14 15 16 17 18 19 24 25 28 29 31 32 33 36 37 40 41 42 43; U3 6 9; U9 4; U11 6; U13 3; USB1 A8 B8

## Via types
v1: diameter 0.61, hole 0.305, Top Layer to Bottom Layer, 52 vias

## Routing (per net, layer and track width the routed paths; a pad name or vN(x,y) marks a point on that pad's centre or on a via; arc(x,y) is an arc through that point)
1.1V: length 52.3
  Top Layer w0.254: 10.15,60.51 8.67,59.02 5.45,59.02 4.76,59.71 C23.1 4.63,60.83 C22.1 ; 10.15,60.51 C20.1 C17.1 ; 10.15,60.51 v1(10.15,59.4) ; U1.6 12.31,44.2 ; U1.23 14.47,41.24 ; U1.39 16.63,43.8 ; U1.50 15.67,47.51 16.28,48.13 19.08,48.13 L1.2 19.18,48.74 v1(18.66,48.74)
  POWERS w0.254: v1(16.87,43.8) 17.28,43.8 17.9,44.42 17.9,52.67 11.17,59.4 v1(10.15,59.4)
  Bottom Layer w0.254: v1(18.66,48.74) 18.02,48.1 18.02,44.16 17.84,43.98 17.06,43.98 v1(16.87,43.8)
3.3V: length 71.3
  Top Layer w0.254: 13.27,39.83 13.27,39.15 ; U8.8 v1(13.2,55.59) ; v1(10.66,46.7) 10.89,46.47 U1.1 ; v1(8.37,20.41) 7.82,20.97 7.63,20.97 7.58,20.92 7.27,20.92 5.72,22.47 U11.5 ; v1(18.79,39.46) 18.42,39.83 17.27,39.83 ; U1.11 v1(11.68,42.2) ; U1.38 18.91,43.4 20.51,45 R11.1 20.64,45.05 19.8,45.05 v1(18.91,45.94) 18.3,45.94 U1.45 U1.44 ; 27.93,48.67 C2.1 ; 27.93,50.26 27.8,50.13 v1(27.42,50.13) ; U13.6 15.98,10.14 v1(16.25,9.87) ; U1.49 16.05,46.96 16.05,46.42 15.88,46.26 14.65,46.26 14.59,46.32 v1(14.21,46.32) ; U3.1 v1(1.64,46.58) ; C5.1 23.93,55.2 ; 25.07,65.69 v1(25.14,65.75)
  Top Layer w0.35: C2.1 C1.1 27.87,46.13 27.55,45.81 26.53,45.81 24.7,43.98 C4.1 23.14,40.1 R12.2 R13.2 22.78,37.99 21.9,37.11 C9.1 C10.1 ; 23.56,75.06 24.67,73.95 U9.5 25.77,70.2 25.77,66.39 v1(25.14,65.75) ; U3.8 v1(7.24,41.37) ; 27.93,48.67 27.93,50.26 25.14,53.05 C7.1 23.93,55.2 ; C18.1 C15.2 25.07,65.69 ; 13.22,39.15 12.37,38.31 v1(12.37,38.26) ; 2.08,53.05 2.08,47.03 v1(1.64,46.58)
  Top Layer w0.4: 14.21,46.83 v1(14.21,46.32)
5V_USB: length 102.6
  Top Layer w0.254: 18.16,77.99 18.16,78.99 17.65,79.5 13.97,79.5 13.59,79.12 13.59,77.99
  Top Layer w0.4: 20.96,71.25 20.83,71.12 20.83,69.47 21.01,69.29 21.95,69.29 22.07,69.41 ; 20.96,71.25 D2.5 ; 20.96,71.25 21.64,71.25 21.7,71.31 22.07,71.31 22.07,72.63 18.28,76.42 USB1.A4B9 ; LED1.1 v1(14.8,64.64) 14.35,64.64 13.08,65.91 13.08,71.25 11.37,72.96 C11.1 10.16,74.68 11.18,75.69 12.57,75.69 13.47,76.59 USB1.B4A9 ; U10.3 18.56,14.08 v1(19.43,13.21) 19.43,11.65
  Bottom Layer w0.4: v1(19.43,13.21) 22.48,16.26 22.48,47.07 14.8,54.76 v1(14.8,64.64)
GND: length 26.5
  Top Layer w0.254: C21.2 10.96,63.68 11.62,63.01 11.62,60.58 ; C23.2 6.03,60.83 6.03,66.67 ; C9.2 C10.2 ; v1(16.87,46.19) 16.87,46.97 16.87,46.98 ; R1.2 18.66,74.48 v1(18.66,73.63) ; U2.4 12.14,35.65 C13.2 ; C8.2 C6.2 ; U2.2 14.84,34.04 17.15,31.73
  vias: v1(13.33,44.54) v1(13.32,43.4) v1(13.35,42.2) v1(14.47,44.54) v1(14.47,43.4) v1(14.47,42.19) v1(15.63,44.54) v1(15.6,43.4) v1(15.63,42.2)
D+: length 8.2
  Top Layer w0.254: USB1.B6 15.12,78.24 15.44,78.56 15.8,78.56 16.13,78.23 16.13,77.52 USB1.A6
  Top Layer w0.35: USB1.B6 15.12,76.82 14.72,76.42 14.72,72.32 D2.1
D-: length 10.1
  Top Layer w0.254: USB1.A7 15.63,76.7 16,76.33 16.26,76.33 16.63,76.7 USB1.B7
  Top Layer w0.35: 15.63,76.7 15.58,76.66 15.58,70.8 15.23,70.45 14.76,70.45 D2.3
GPIO2: length 9.6
  Top Layer w0.254: U1.4 10.2,45 v1(9.77,45.43) ; v1(3.29,45.18) 3.26,45.21 U3.2
  GND w0.254: v1(3.29,45.18) 3.55,45.43 v1(9.77,45.43)
GPIO3: length 9.5
  Top Layer w0.254: v1(9.64,44.67) 9.71,44.6 U1.5 ; U3.3 3.15,44.56 v1(3.29,44.42)
  GND w0.254: v1(3.29,44.42) 9.39,44.42 v1(9.64,44.67)
GPIO4: length 9.4
  Top Layer w0.254: U1.7 10.13,43.8 10.11,43.82 v1(9.49,43.82) ; v1(3.29,43.66) 3.11,43.83 3.05,43.83 2.97,43.91 U3.4
  GND w0.254: v1(9.49,43.82) 9.32,43.66 v1(3.29,43.66)
GPIO5: length 9.7
  Top Layer w0.254: U3.5 2.8,43.26 v1(3.29,42.77) ; 10.87,43.38 10.22,43.38 10.2,43.4 9.9,43.4 9.56,43.06 v1(9.46,43.06)
  GND w0.254: v1(9.46,43.06) 9.17,42.77 v1(3.29,42.77)
GPIO6: length 23.9
  Top Layer w0.254: v1(8.5,21.68) 8.28,21.47 7.63,21.47 ; v1(10.28,37.94) 9.9,38.32 9.9,42.54 10.34,42.98 10.87,42.98 U1.9
  Bottom Layer w0.254: v1(8.5,21.68) 8.5,36.16 v1(10.28,37.94)
GPIO16: length 3.3
  Top Layer w0.254: U1.27 16.07,37.56 R5.2
I2C1_SCL: length 41.1
  Top Layer w0.254: v1(11.67,9.75) 11.49,9.75 U13.5 ; R12.1 21.71,40.3 ; 21.71,40.3 19.81,42.2 U1.35 ; 21.71,40.3 v1(21.71,40.73)
  Bottom Layer w0.254: v1(21.71,40.73) 21.71,19.78 v1(11.67,9.75)
I2C1_SDA: length 41.3
  Top Layer w0.254: 21.2,38.96 21.38,38.78 21.86,38.78 R13.1 ; 21.2,38.96 21.07,38.96 v1(20.82,38.7) ; 21.2,38.96 21.2,40.1 19.5,41.8 U1.34 ; U13.4 v1(9.77,10.64)
  Bottom Layer w0.254: v1(20.82,38.7) 21.07,38.45 21.07,20.54 11.17,10.64 v1(9.77,10.64)
IN+: length 23.9
  Top Layer w0.254: 16.64,20.74 14.17,23.21 10.53,23.21 10.24,22.91 R6.2 ; 16.64,20.74 21.81,20.74 R10.2 ; 16.64,20.74 16.45,20.55 16.45,13.25 15.34,12.14 U13.10
QSPI_SCLK: length 9.4
  Top Layer w0.254: U8.6 14.82,53.18 15.08,53.43 15.87,53.43 16.5,52.8 16.5,50.89 13.25,47.64 13.25,47 13.27,46.98
QSPI_SD0: length 6.3
  Top Layer w0.254: 12.87,46.98 12.87,47.85 15.61,50.59 15.61,51 U8.5
QSPI_SD1: length 12.9
  Top Layer w0.254: U8.2 6.85,54.32 5.96,53.43 5.96,51.28 7.61,49.62 10.53,49.62 12.07,48.09 U1.59
QSPI_SD2: length 8.8
  Top Layer w0.254: U1.58 12.47,49.72 9.13,53.05 U8.3
QSPI_SD3: length 10.2
  Top Layer w0.254: U1.55 13.69,47 13.69,47.53 17.01,50.85 17.01,53.05 15.74,54.32 U8.7
QSPI_SS: length 35.4
  Top Layer w0.254: v1(4.56,30.96) 4.56,30.16 BOOTSEL.1 ; 8.5,49.27 7.46,49.27 5.6,51.13 5.6,54.48 6.59,55.47 7.64,55.47 U8.1 ; 8.5,49.27 10.25,49.27 11.67,47.85 U1.60 ; 8.5,49.27 8.75,49.01 v1(8.75,48.61)
  Bottom Layer w0.254: v1(4.56,30.96) 4.56,44.42 v1(8.75,48.61)
RESET: length 32.7
  Top Layer w0.254: 19.43,2.54 19.43,2.79 17.81,4.41 8.41,4.41 6.21,6.61 6.21,15.76 Serial_Header.1 2.79,19.18 2.79,20.32 3.94,21.46 4.82,21.46 U11.7
RUN: length 11.8
  Top Layer w0.254: U1.26 15.67,36.87 20.83,31.7 20.83,30.17
SWCLK: length 64.8
  Top Layer w0.254: v1(9.26,39.72) 9.26,41.5 8.88,41.88 8.88,44.54 8.22,45.21 U3.13
  GND w0.254: H1.4 14.34,6.57 15.48,7.71 27.8,7.71 29.07,8.98 29.07,12.92 27.14,14.86 Debug_Header.3 22.94,14.86 9.26,28.54 v1(9.26,39.72)
SWDIO: length 52.5
  Top Layer w0.254: H1.8 22.96,5.81 Debug_Header.1 ; v1(8.5,39.77) 8.5,44.09 8.04,44.54 7.25,44.54 U3.12
  GND w0.254: v1(8.5,39.77) 8.5,28.2 Debug_Header.1
TARGET_VCC: length 33.9
  Top Layer w0.254: U13.9 U13.8 ; Debug_Header.4 25.48,18.84 R10.1 ; 14.44,11.37 14.37,11.3
  Top Layer w0.4: Debug_Header.4 23.74,14.21 23.74,9.51 21.81,7.59 13.59,7.59 ; 13.59,7.59 13.59,10.52 14.37,11.3 ; 13.59,7.59 12.94,7.59 11.81,6.45 11.81,5.08 ; 15.31,11.37 14.44,11.37
UART_RX: length 50.4
  Top Layer w0.254: v1(1.9,12.41) 1.67,12.64 1.67,34.79 5.32,38.44 5.32,43.4 5.83,43.91 U3.11 ; Serial_Header.4 4.95,9.4 4.95,6.48 8.89,2.54 11.81,2.54
  Bottom Layer w0.254: Serial_Header.4 4.53,9.78 v1(1.9,12.41)
UART_TX: length 55.3
  Top Layer w0.254: U3.10 6.07,43.26 5.83,43.02 5.83,38.45 2.02,34.64 2.02,14.87 Serial_Header.3 2.79,10.54 2.79,7.49 9.27,1.02 12.83,1.02 14.35,2.54
USB_DN: length 22.1
  Top Layer w0.254: R4.2 17.15,67.26 16.71,66.83 16.71,54.43 17.77,53.37 17.77,50.11 15.29,47.63 15.29,46.98
USB_DP: length 21.9
  Top Layer w0.254: 14.88,47.08 14.88,47.8 17.36,50.28 17.36,53.2 16.31,54.26 16.31,66.7 R3.1
VTARGET: length 29.8
  Top Layer w0.254: U3.14 8.04,45.86 v1(8.5,46.32) ; U11.8 5.13,20.65 v1(5.13,20.22)
  Bottom Layer w0.254: v1(8.5,46.32) 8.5,40.6 7.92,40.01 7.92,23.01 v1(5.13,20.22)
XIN: length 12.1
  Top Layer w0.254: C13.1 7.93,34.83 9.01,33.75 11.93,33.75 U2.1 12.22,34.05 13.45,35.27 13.45,38.06 13.67,38.28 13.67,38.98 13.67,38.99 13.67,39.82 U1.21
XOUT: length 9.2
  Top Layer w0.254: U1.22 14.07,39.29 14.43,38.94 U2.3 15.12,35.74 18.14,32.72
$1N4816: length 3
  Top Layer w0.254: USB1.A5 17.12,75.33 17.6,74.85 R1.1
$1N4872: length 3.5
  Top Layer w0.254: USB1.B5 14.12,75.85 13.08,74.8 R2.1
$1N5063: length 4.7
  Top Layer w0.254: 15.98,69.83 15.98,71.61 16.44,72.07 16.77,72.07 D2.6
  Top Layer w0.4: R3.2 15.75,69.6 15.96,69.8
$1N5093: length 2.3
  Top Layer w0.4: R4.1 17.27,69.92 D2.4
$1N6963: length 28.2
  Top Layer w0.254: LED1.4 19.9,62.99 v1(20.69,62.2) ; v1(17.64,37.56) 17.7,37.51 R5.1
  GND w0.254: v1(17.64,37.56) 17.77,37.69 17.77,57.63 20.69,60.55 v1(20.69,62.2)
$1N6977: length 9.1
  Top Layer w0.254: 13.96,15.2 12.69,15.2 11.1,16.78 R7.1 R6.1
$1N7783: length 6.5
  Top Layer w0.254: U1.48 16.47,47.51 16.65,47.69 17.48,47.69 17.97,47.21 20.56,47.21 21.44,48.08 L1.1
$1N8068: length 8
  Top Layer w0.254: 17.27,46.7 20.31,46.7 20.69,46.32 R11.2 21.15,45.87 21.58,45.43 21.58,44.29 20.63,43.34 C19.1
$1N9279: length 4
  Top Layer w0.254: 14.42,27.78 12.98,26.34 BOOTSEL.4

## Copper pours and planes (outline as drawn; the poured copper is in the pictures)
1.1V on Top Layer: 12.13,41.04 12.13,45.83 16.92,45.83 16.92,41.04
3.3V on POWERS: 0.12,85.57 31.36,85.57 31.36,-0.67 0.12,-0.67
GND on Top Layer: -1.15,84.93 31.87,84.93 31.87,-0.29 -1.15,-0.29
GND on Bottom Layer: -0.64,84.42 31.74,84.42 31.74,-0.54 -0.64,-0.54
GND on GND: -2.17,86.58 33.01,86.58 33.01,-2.95 -2.17,-2.95

## Text on the board
Top Silkscreen Layer: TX | RX | RST | GND | VCC | SWCLK | SWDIO | Debug / signal
